# EasyEDA schematic schematic.json

## Sheets
1 Horizontal_USB: TITLE: Sheet_1; REV: 1.0; Date: 2024-07-05; Sheet: 1/1; Drawn By: yaddle.yoda.flash; Company: Your Company
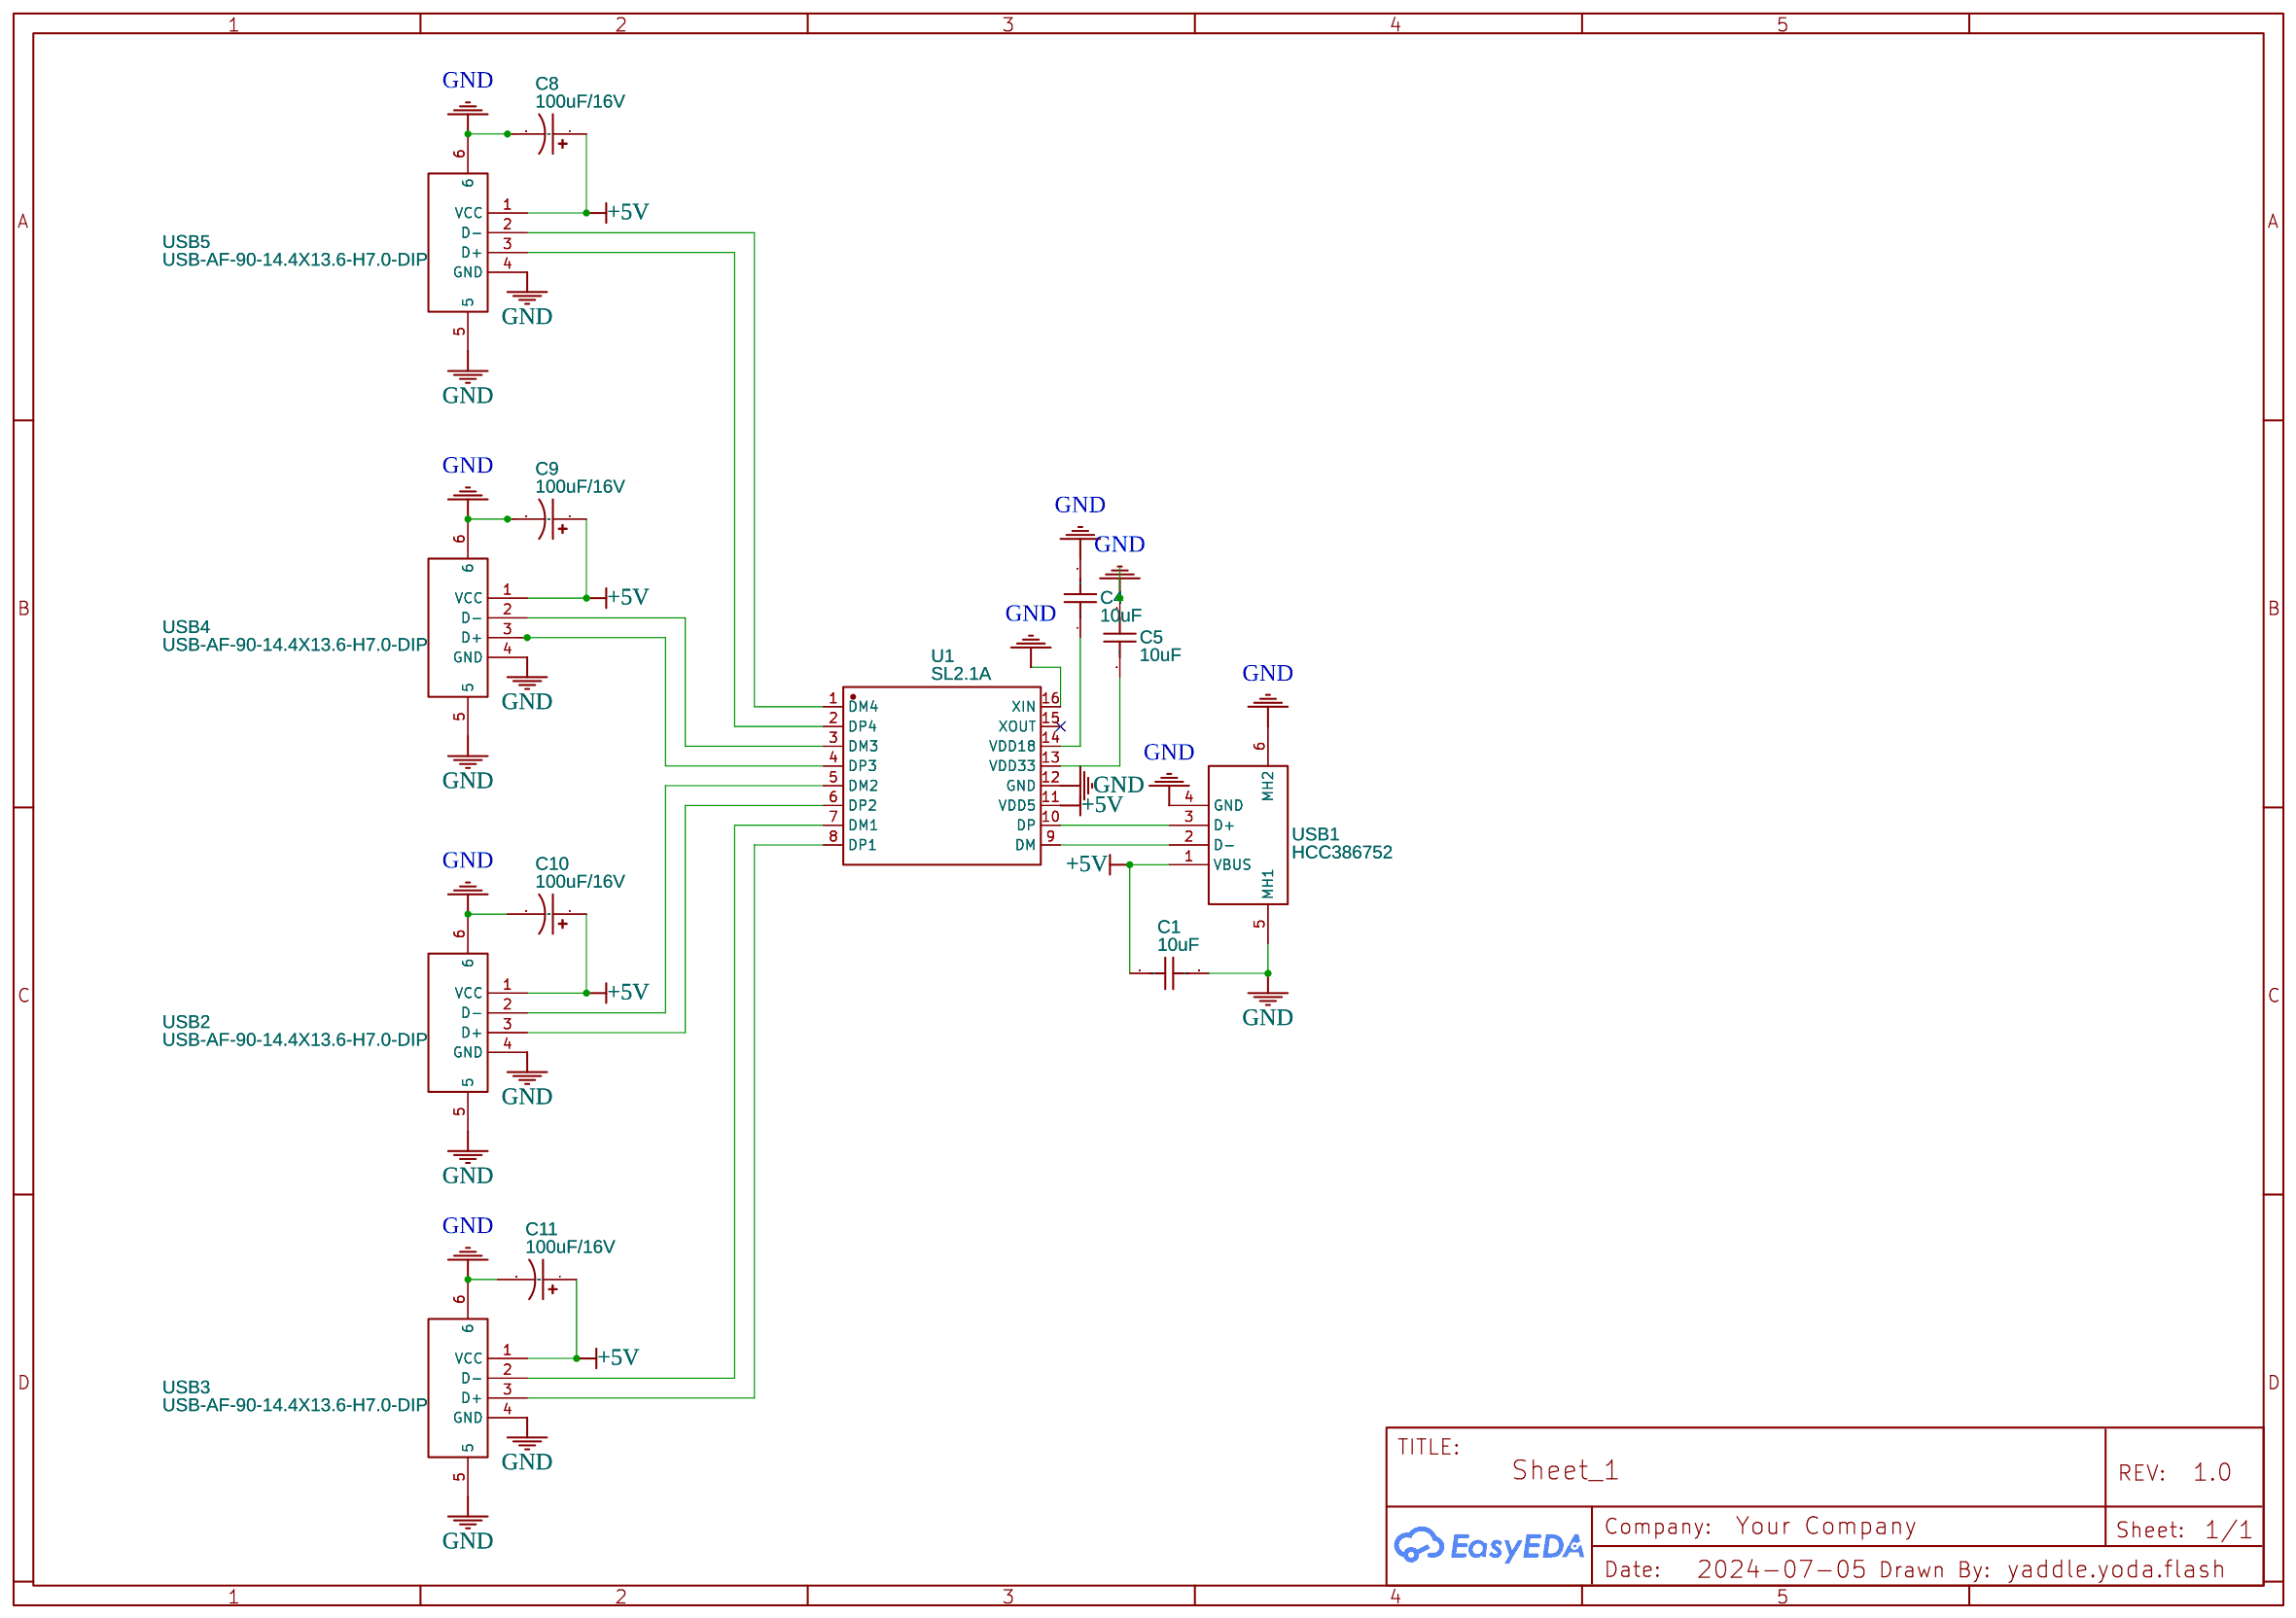
[diagram p0: Horizontal_USB]
2 Vertical_USB: Date: 2024-07-12
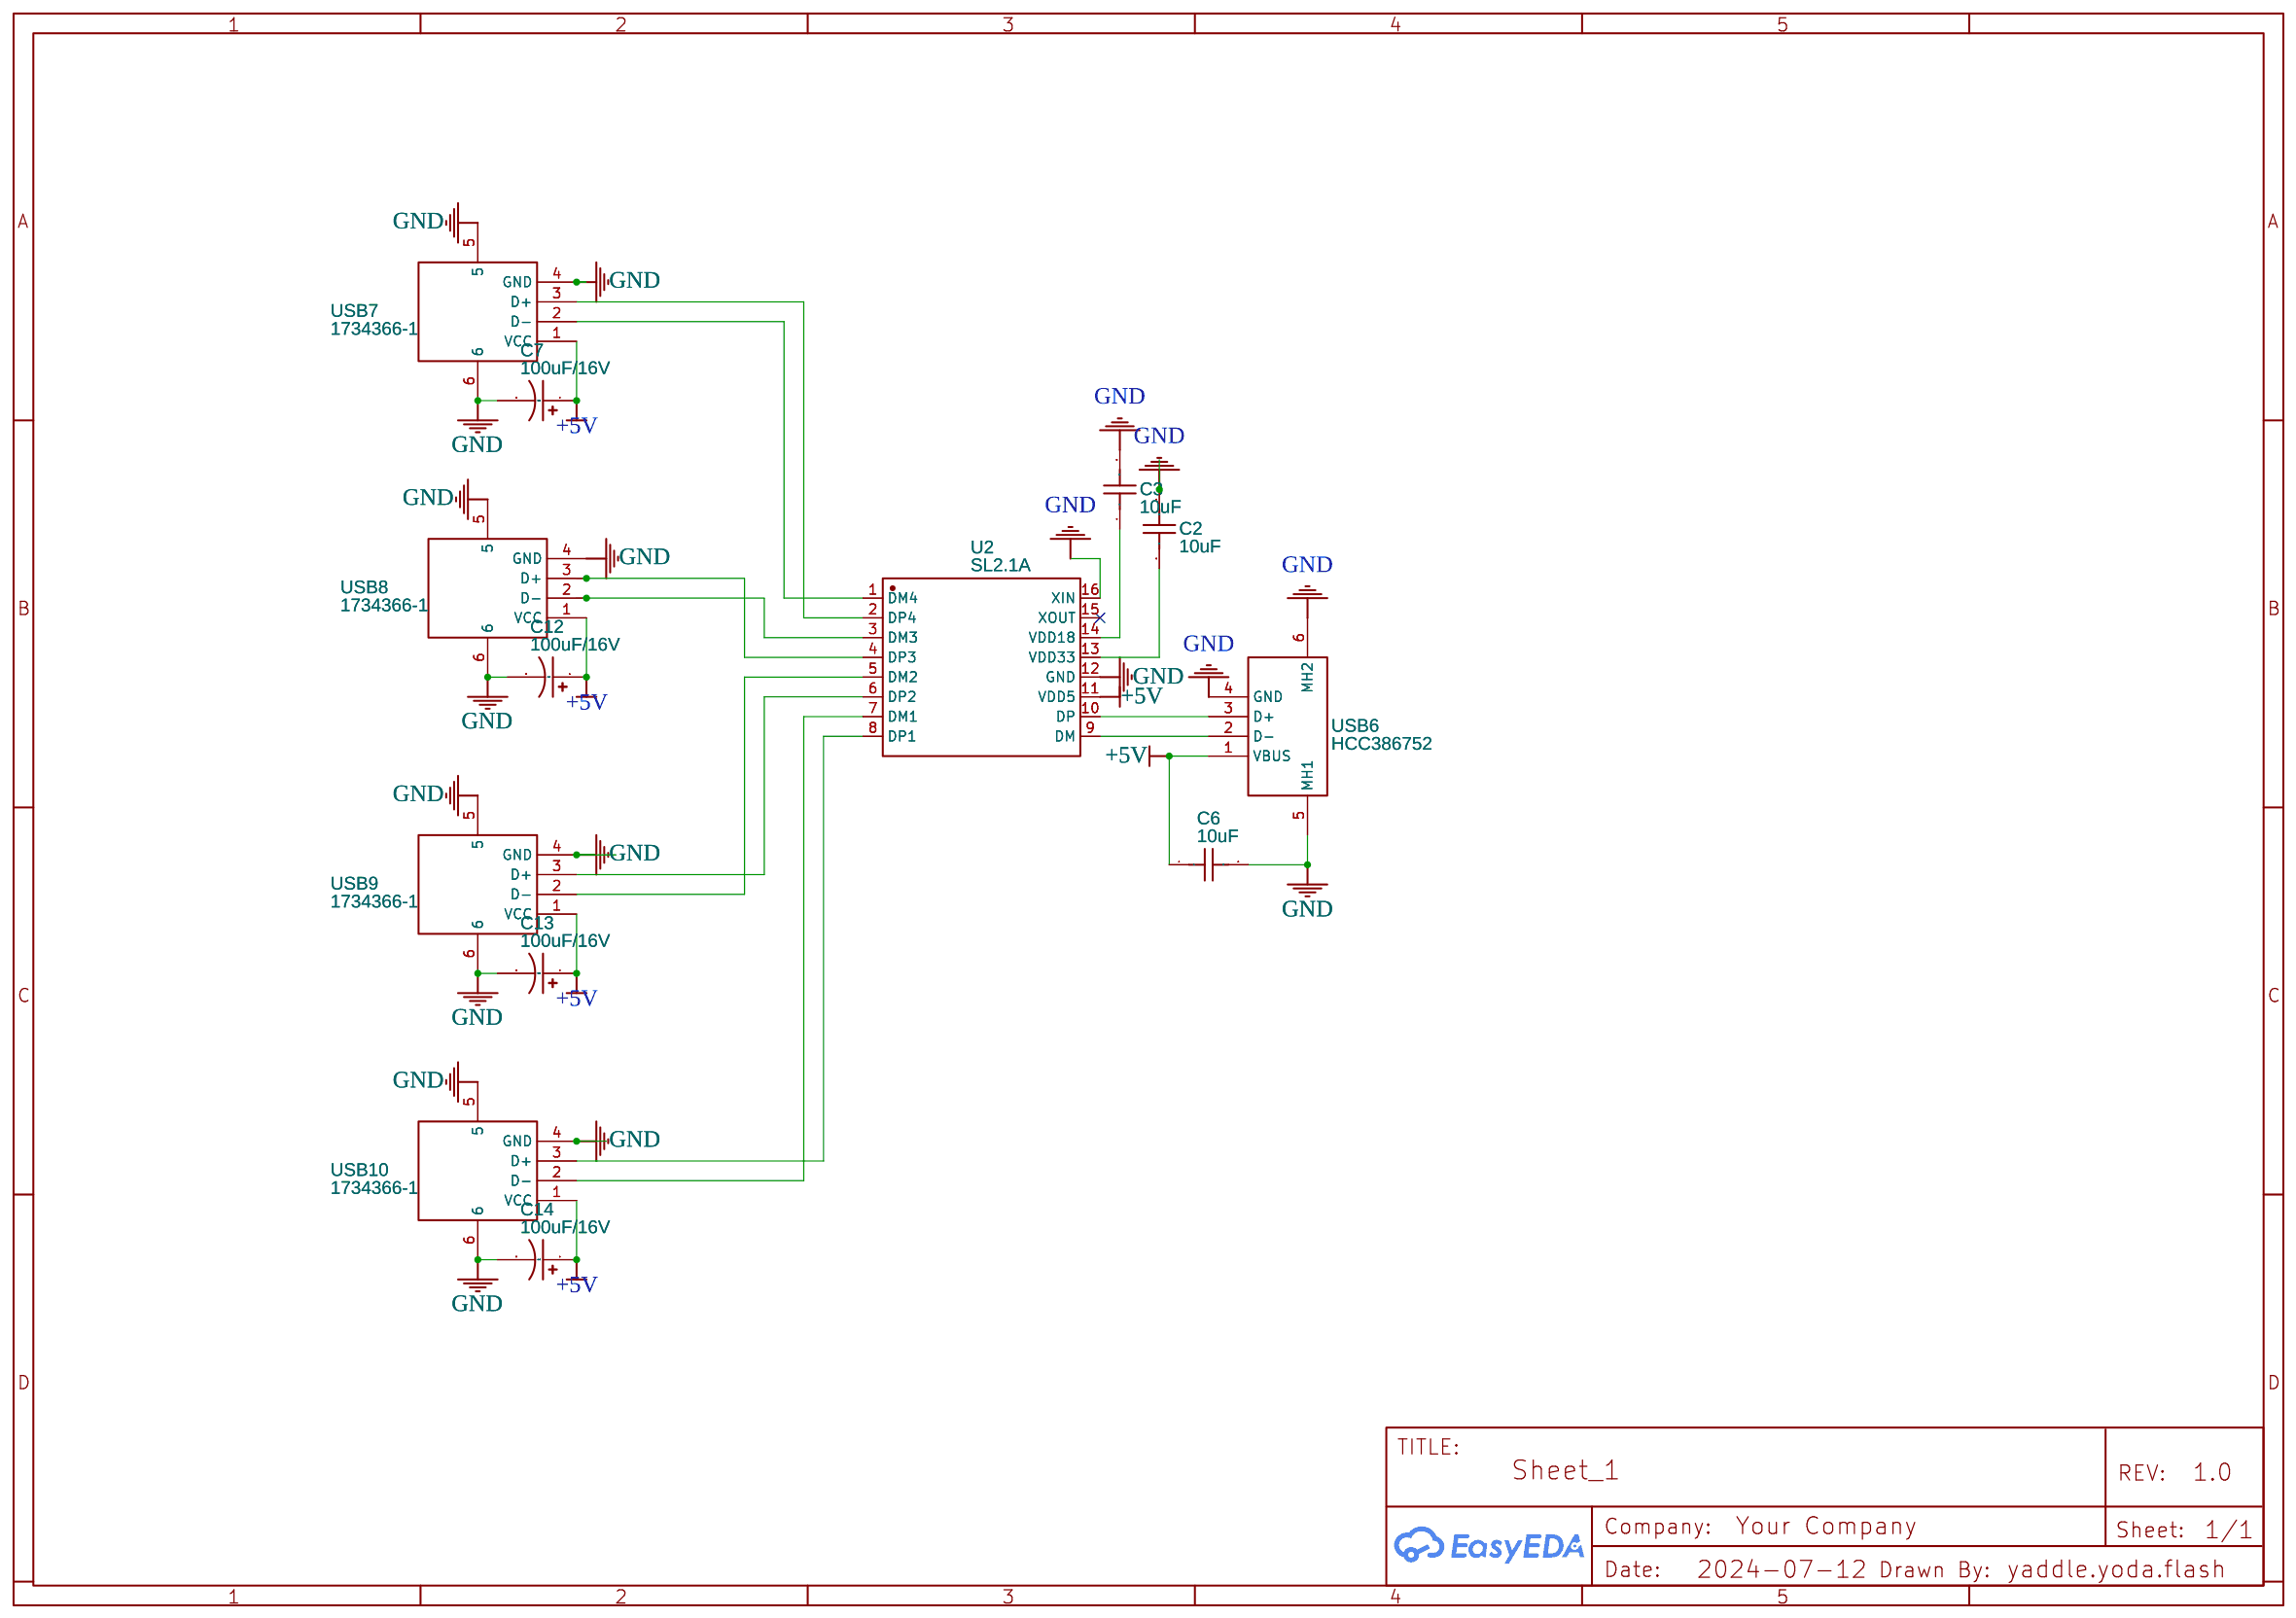
[diagram p1: Vertical_USB]

## Parts
sheet Horizontal_USB
C1  10uF  [C0603]
C4  10uF  [C0603]
C5  10uF  [C0603]
C8  100uF/16V  [CASE-A_3216]
C9  100uF/16V  [CASE-A_3216]
C10  100uF/16V  [CASE-A_3216]
C11  100uF/16V  [CASE-A_3216]
U1  SL2.1A  [SOP-16_L10.0-W3.9-P1.27-LS6.0-BL]
USB1  HCC386752  [USB-SMD_KH-USB-AM-4P-CB_FIXED]
USB2  USB-AF-90-14.4X13.6-H7.0-DIP  [USB-A-TH_C46407]
USB3  USB-AF-90-14.4X13.6-H7.0-DIP  [USB-A-TH_C46407]
USB4  USB-AF-90-14.4X13.6-H7.0-DIP  [USB-A-TH_C46407]
USB5  USB-AF-90-14.4X13.6-H7.0-DIP  [USB-A-TH_C46407]
sheet Vertical_USB
C2  10uF  [C0603]
C3  10uF  [C0603]
C6  10uF  [C0603]
C7  100uF/16V  [CASE-A_3216]
C12  100uF/16V  [CASE-A_3216]
C13  100uF/16V  [CASE-A_3216]
C14  100uF/16V  [CASE-A_3216]
U2  SL2.1A  [SOP-16_L10.0-W3.9-P1.27-LS6.0-BL]
USB6  HCC386752  [USB-SMD_KH-USB-AM-4P-CB_FIXED]
USB7  1734366-1  [USB-A-TH_FUS264-FDSW3K]
USB8  1734366-1  [USB-A-TH_FUS264-FDSW3K]
USB9  1734366-1  [USB-A-TH_FUS264-FDSW3K]
USB10  1734366-1  [USB-A-TH_FUS264-FDSW3K]

## Library data of the parts
C1-C6 = CL10A106KP8NNNC: Supplier: LCSC; Manufacturer: SAMSUNG(三星); Supplier Part: C19702; JLCPCB Part Class: Basic Part
C7-C14 = C_Tan_SMD_A_US: Contributor: LCEDA_Lib
U1 U2 = SL2.1A: Contributor: LCSC; Supplier: LCSC; Supplier Part: C192893; Manufacturer: CoreChips(和芯润德); JLCPCB Part Class: Extended Part
USB1 USB6 = HCC386752: Contributor: Penguin Kothe; Supplier: LCSC; Supplier Part: C386752; Manufacturer: Ckmtw(灿科盟); Manufacturer Part: U-USBAR04P-M003; JLCPCB Part Class: Extended Part
USB2-USB5 = USB-AF-90-14.4X13.6-H7.0-DIP: Contributor: LCSC; Supplier: LCSC; Supplier Part: C46407; Manufacturer: 精拓金; Manufacturer Part: 903-131A1011D10100; JLCPCB Part Class: Extended Part
USB7-USB10 = 1734366-1: Contributor: LCSC; Supplier: LCSC; Supplier Part: C305910; Manufacturer: TE Connectivity(泰科电子); JLCPCB Part Class: Extended Part

## Nets
+5V: C1.1 C6.1 C7.1 C8.1 C9.1 C10.1 C11.1 C12.1 C13.1 C14.1 U1.11(VDD5) U2.11(VDD5) USB1.1(VBUS) USB2.1(VCC) USB3.1(VCC) USB4.1(VCC) USB5.1(VCC) USB6.1(VBUS) USB7.1(VCC) USB8.1(VCC) USB9.1(VCC) USB10.1(VCC)
GND: C1.2 C2.1 C3.2 C4.2 C5.1 C6.2 C7.2 C8.2 C9.2 C10.2 C11.2 C12.2 C13.2 C14.2 U1.12(GND) U1.16(XIN) U2.12(GND) U2.16(XIN) USB1.4(GND) USB1.5(MH1) USB1.6(MH2) USB2.4(GND) USB2.5 USB2.6 USB3.4(GND) USB3.5 USB3.6 USB4.4(GND) USB4.5 USB4.6 USB5.4(GND) USB5.5 USB5.6 USB6.4(GND) USB6.5(MH1) USB6.6(MH2) USB7.4(GND) USB7.5 USB7.6 USB8.4(GND) USB8.5 USB8.6 USB9.4(GND) USB9.5 USB9.6 USB10.4(GND) USB10.5 USB10.6
Net-(C2-2): C2.2 U2.13(VDD33)
Net-(C3-1): C3.1 U2.14(VDD18)
Net-(C4-1): C4.1 U1.14(VDD18)
Net-(C5-2): C5.2 U1.13(VDD33)
Net-(U1-1): U1.1(DM4) USB5.2(D-)
Net-(U1-2): U1.2(DP4) USB5.3(D+)
Net-(U1-3): U1.3(DM3) USB4.2(D-)
Net-(U1-4): U1.4(DP3) USB4.3(D+)
Net-(U1-5): U1.5(DM2) USB2.2(D-)
Net-(U1-6): U1.6(DP2) USB2.3(D+)
Net-(U1-7): U1.7(DM1) USB3.2(D-)
Net-(U1-8): U1.8(DP1) USB3.3(D+)
Net-(U1-9): U1.9(DM) USB1.2(D-)
Net-(U1-10): U1.10(DP) USB1.3(D+)
Net-(U2-1): U2.1(DM4) USB7.2(D-)
Net-(U2-2): U2.2(DP4) USB7.3(D+)
Net-(U2-3): U2.3(DM3) USB8.2(D-)
Net-(U2-4): U2.4(DP3) USB8.3(D+)
Net-(U2-5): U2.5(DM2) USB9.2(D-)
Net-(U2-6): U2.6(DP2) USB9.3(D+)
Net-(U2-7): U2.7(DM1) USB10.2(D-)
Net-(U2-8): U2.8(DP1) USB10.3(D+)
Net-(U2-9): U2.9(DM) USB6.2(D-)
Net-(U2-10): U2.10(DP) USB6.3(D+)

Not connected (* = marked no-connect by the designer): U1 15(XOUT)*; U2 15(XOUT)*
